# Altium schematic sheet Bank.SchDoc
size A3
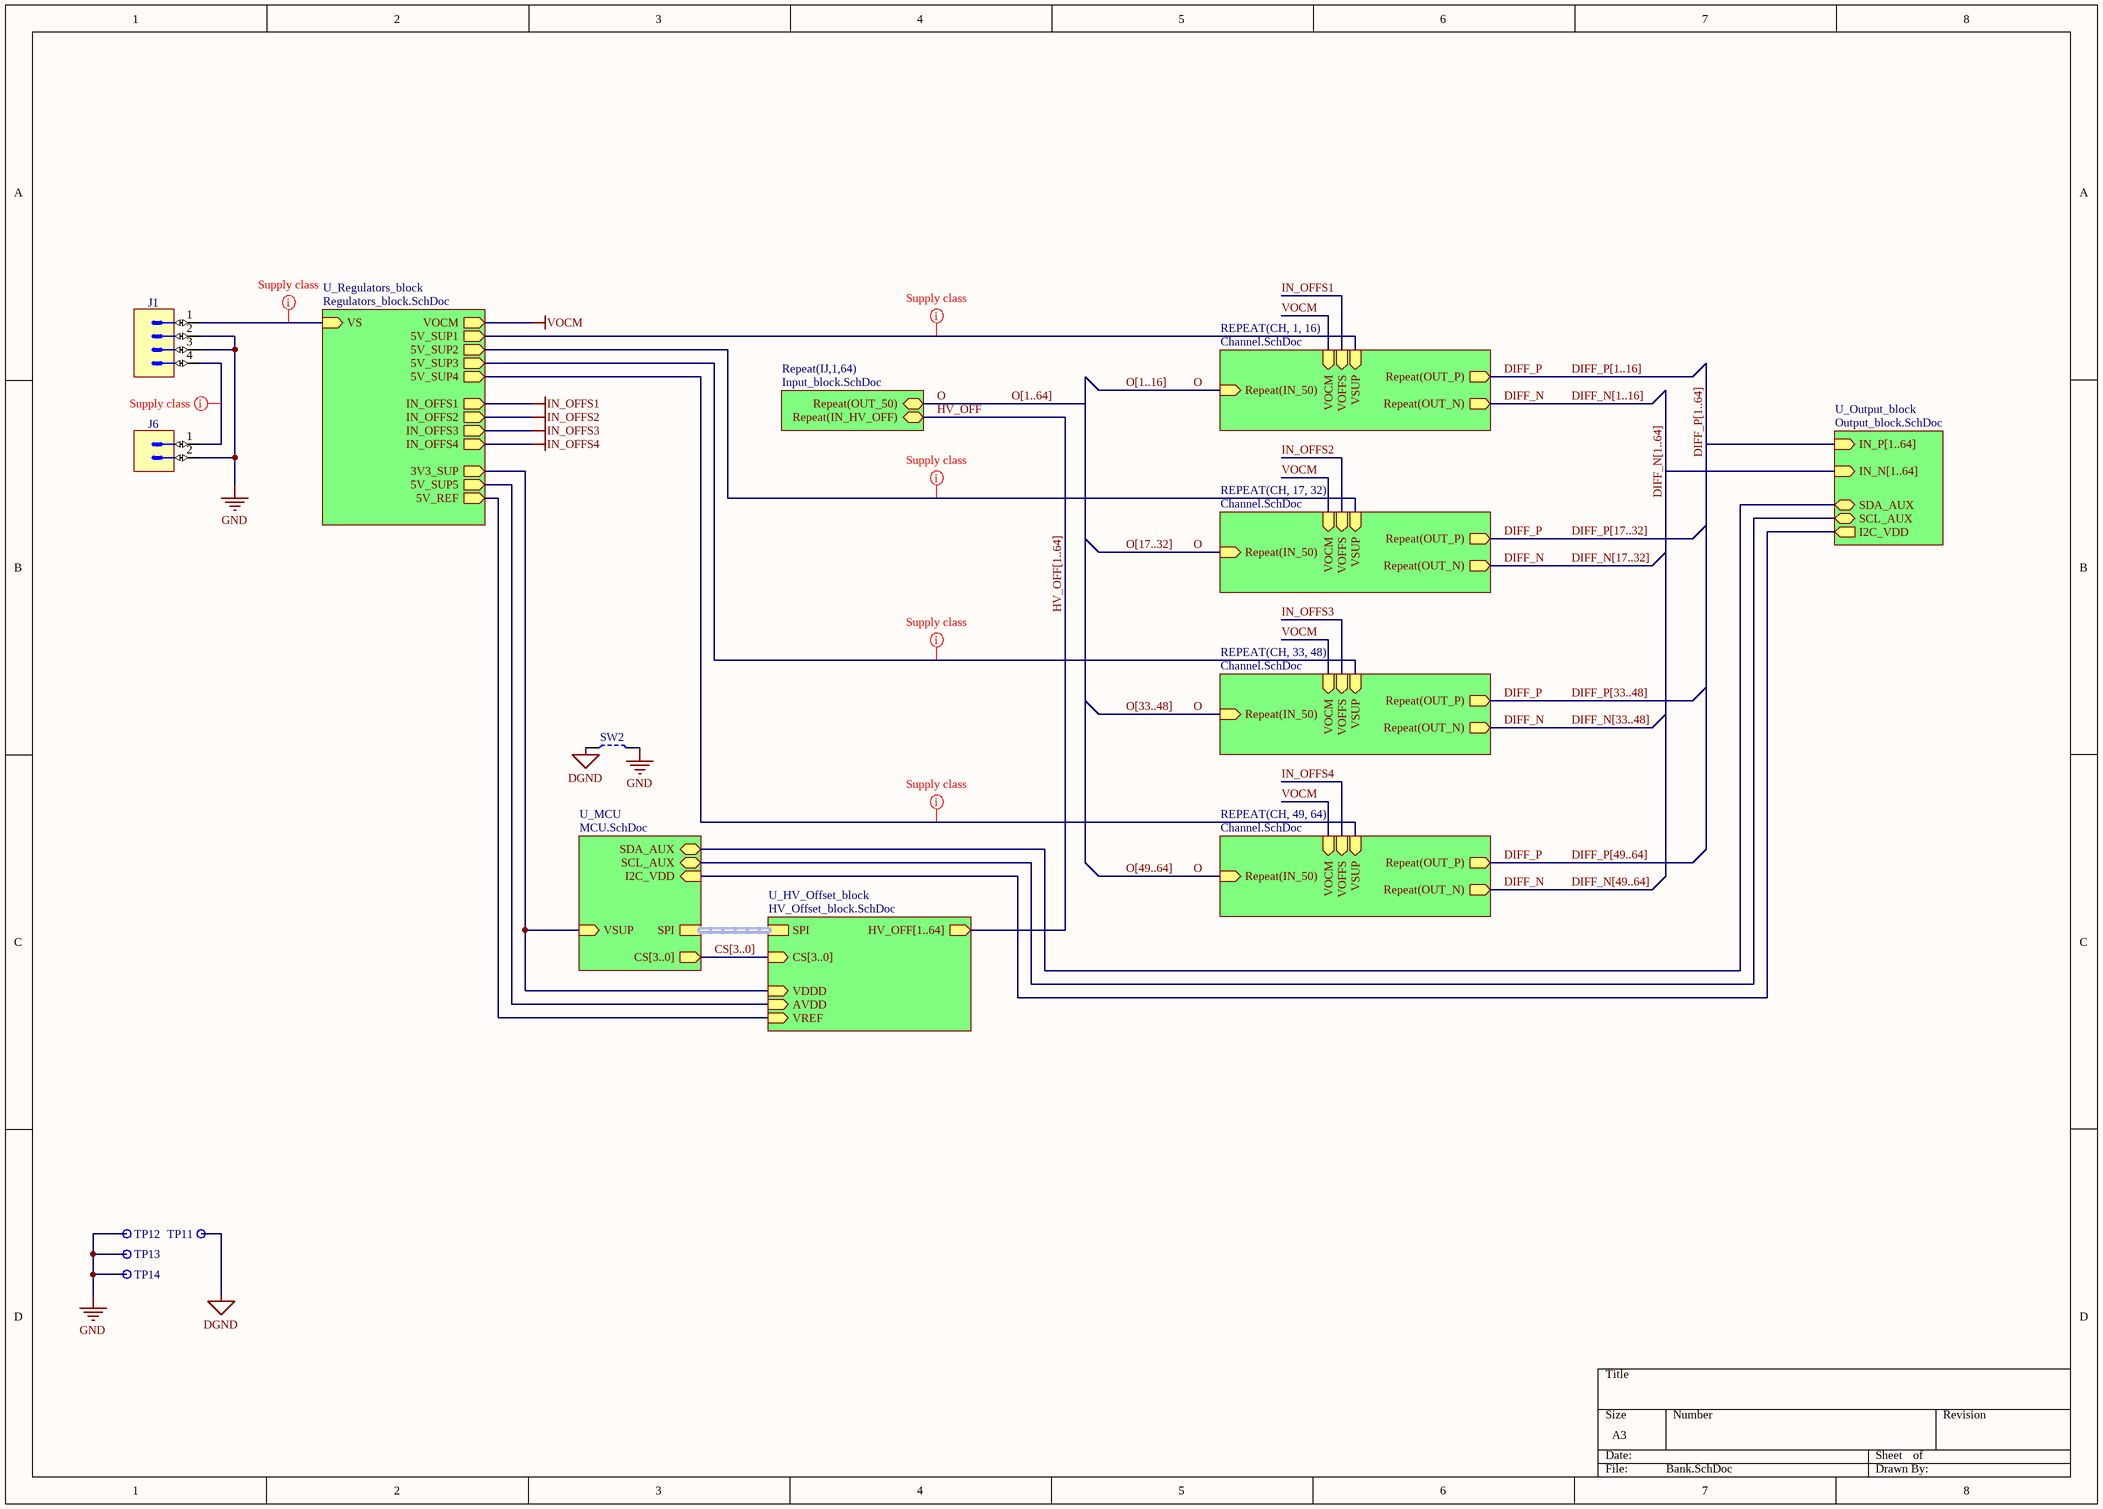
[diagram p0: Bank.SchDoc]

## Parts
J1  Header 4  [WURTH_691 313 410 004]  (value not drawn)
J6  KK®  [MOLEX_22-04-1021]  (value not drawn)
SW2  Switch  [JUMPSMD0805_G50]  (value not drawn)
TP11  Test Point  [VERO_20-313145]  (value not drawn)
TP12  Test Point  [VERO_20-313145]  (value not drawn)
TP13  Test Point  [VERO_20-313145]  (value not drawn)
TP14  Test Point  [VERO_20-313145]  (value not drawn)

## Sub-sheets
REPEAT(CH, 1, 16) = Channel.SchDoc: Repeat(OUT_N) (out), Repeat(OUT_P) (out), VSUP (in), Repeat(IN_50) (in), VOFFS (in), VOCM (in)
REPEAT(CH, 17, 32) = Channel.SchDoc: Repeat(OUT_N) (out), Repeat(OUT_P) (out), VSUP (in), Repeat(IN_50) (in), VOCM (in), VOFFS (in)
REPEAT(CH, 33, 48) = Channel.SchDoc: Repeat(OUT_N) (out), Repeat(OUT_P) (out), VSUP (in), Repeat(IN_50) (in), VOCM (in), VOFFS (in)
REPEAT(CH, 49, 64) = Channel.SchDoc: Repeat(OUT_N) (out), Repeat(OUT_P) (out), VSUP (in), Repeat(IN_50) (in), VOCM (in), VOFFS (in)
Repeat(IJ,1,64) = Input_block.SchDoc: Repeat(OUT_50) (bidir), Repeat(IN_HV_OFF) (bidir)
U_HV_Offset_block = HV_Offset_block.SchDoc: SPI (harness SPI), CS[3..0] (in), HV_OFF[1..64] (out), VDDD (in), AVDD (in), VREF (in)
U_MCU = MCU.SchDoc: CS[3..0] (out), VSUP (in), SPI (harness SPI), SDA_AUX (bidir), SCL_AUX (bidir), I2C_VDD (in)
U_Output_block = Output_block.SchDoc: IN_P[1..64] (in), IN_N[1..64] (in), I2C_VDD (out), SCL_AUX (bidir), SDA_AUX (bidir)
U_Regulators_block = Regulators_block.SchDoc: VS (in), IN_OFFS3 (out), 5V_SUP2 (out), VOCM (out), 5V_SUP4 (out), 5V_REF (out), IN_OFFS2 (out), 3V3_SUP (out), 5V_SUP3 (out), IN_OFFS1 (out), IN_OFFS4 (out), 5V_SUP1 (out), 5V_SUP5 (out)

## Nets
DGND: SW2.1 TP11.1
GND: J1.2 J1.3 J6.2 SW2.2 TP12.1 TP13.1 TP14.1
IN_OFFS1: sheet REPEAT(CH, 1, 16)/VOFFS, sheet U_Regulators_block/IN_OFFS1
IN_OFFS2: sheet REPEAT(CH, 17, 32)/VOFFS, sheet U_Regulators_block/IN_OFFS2
IN_OFFS3: sheet REPEAT(CH, 33, 48)/VOFFS, sheet U_Regulators_block/IN_OFFS3
IN_OFFS4: sheet REPEAT(CH, 49, 64)/VOFFS, sheet U_Regulators_block/IN_OFFS4
VOCM: sheet REPEAT(CH, 1, 16)/VOCM, sheet REPEAT(CH, 17, 32)/VOCM, sheet REPEAT(CH, 33, 48)/VOCM, sheet REPEAT(CH, 49, 64)/VOCM, sheet U_Regulators_block/VOCM
DIFF_N: sheet REPEAT(CH, 1, 16)/Repeat(OUT_N), sheet REPEAT(CH, 17, 32)/Repeat(OUT_N), sheet REPEAT(CH, 33, 48)/Repeat(OUT_N), sheet REPEAT(CH, 49, 64)/Repeat(OUT_N)
DIFF_P: sheet REPEAT(CH, 1, 16)/Repeat(OUT_P), sheet REPEAT(CH, 17, 32)/Repeat(OUT_P), sheet REPEAT(CH, 33, 48)/Repeat(OUT_P), sheet REPEAT(CH, 49, 64)/Repeat(OUT_P)
HV_OFF: sheet Repeat(IJ,1,64)/Repeat(IN_HV_OFF)
O: sheet REPEAT(CH, 1, 16)/Repeat(IN_50), sheet REPEAT(CH, 17, 32)/Repeat(IN_50), sheet REPEAT(CH, 33, 48)/Repeat(IN_50), sheet REPEAT(CH, 49, 64)/Repeat(IN_50), sheet Repeat(IJ,1,64)/Repeat(OUT_50)
NetJ1_1: J1.1 ; sheet U_Regulators_block/VS
NetJ1_4: J1.4 J6.1
(unnamed): sheet REPEAT(CH, 1, 16)/VSUP, sheet U_Regulators_block/5V_SUP1
(unnamed): sheet REPEAT(CH, 17, 32)/VSUP, sheet U_Regulators_block/5V_SUP2
(unnamed): sheet U_Output_block/I2C_VDD, sheet U_MCU/I2C_VDD
(unnamed): sheet U_Output_block/SCL_AUX, sheet U_MCU/SCL_AUX
(unnamed): sheet U_Output_block/SDA_AUX, sheet U_MCU/SDA_AUX
(unnamed): sheet REPEAT(CH, 33, 48)/VSUP, sheet U_Regulators_block/5V_SUP3
(unnamed): sheet REPEAT(CH, 49, 64)/VSUP, sheet U_Regulators_block/5V_SUP4
(unnamed): sheet U_HV_Offset_block/VDDD, sheet U_MCU/VSUP, sheet U_Regulators_block/3V3_SUP
(unnamed): sheet U_HV_Offset_block/AVDD, sheet U_Regulators_block/5V_SUP5
(unnamed): sheet U_HV_Offset_block/VREF, sheet U_Regulators_block/5V_REF

## Buses and harness runs
bus CS[3..0] = sheet U_HV_Offset_block/CS[3..0] = sheet U_MCU/CS[3..0]
bus DIFF_N[1..16]
bus DIFF_N[1..64] = sheet U_Output_block/IN_N[1..64]
bus DIFF_N[17..32]
bus DIFF_N[33..48]
bus DIFF_N[49..64]
bus DIFF_P[1..16]
bus DIFF_P[1..64] = sheet U_Output_block/IN_P[1..64]
bus DIFF_P[17..32]
bus DIFF_P[33..48]
bus DIFF_P[49..64]
bus HV_OFF[1..64] = sheet U_HV_Offset_block/HV_OFF[1..64]
bus O[1..16]
bus O[1..64]
bus O[17..32]
bus O[33..48]
bus O[49..64]
harness sheet U_HV_Offset_block/SPI = sheet U_MCU/SPI

## Layout directives
net class Supply: (no net found under the mark), NetJ1_1, NetJ1_4

## Library data of the parts
J1 = WURTH_691 313 410 004: Connector 4 Male; Part Description: 4 Contacts, Single Row, Right Angled Serie 3134-7.62mm; Manufacturer: WURTH ELEKTRONIK; PressFit: No; Part Number: WURTH_691 313 410 004; Component Kind: Standard; Component Type: Standard; Pin Count: 4; Family: Header 4; Mounted: Yes; Socket: No; SMD: No; Sense: No; Status: None; Manufacturer Part Number: 691 313 410 004; ComponentHeight: 8.5mm; HelpURL: \\cern.ch\dfs\Applications\Altium\Datasheets\WURTH_691 313 410 004.pdf; Author: CERN DEM MR; CreateDate: 08.04.2016; LatestRevisionDate: 08.04.2016
J6 = MOLEX_22-04-1021: Connector 2 Male; Part Description: 2.5mm (.100") Pitch KK® Wire-to-Board Header, Vertical, with Friction Lock, 2 Circuits, Tin (Sn) Plating; Manufacturer: MOLEX; PressFit: No; Part Number: MOLEX_22-04-1021; Component Kind: Standard; Component Type: Standard; Pin Count: 2; Family: KK®; Mounted: Yes; Socket: No; SMD: No; Sense: No; Status: None; Manufacturer Part Number: 22-04-1021; ComponentHeight: 11.7mm; HelpURL: \\cern.ch\dfs\Applications\Altium\Datasheets\MOLEX_22-04-1021.pdf; Author: CERN DEM JLC; CreateDate: 09.02.2012; LatestRevisionDate: 09.02.2012
SW2 = JUMPSMD0805_G50: 2 SMD Pads for Bound by Solder  Drop; Part Description: 2 SMD Pads for Bound by Solder Drop - Equivalent Size 0805 - Gap 0.5mm; Manufacturer: None; Mounted: No; PressFit: No; Part Number: JUMPSMD0805_G50; Component Kind: Standard (No BOM); Component Type: Standard (No BOM); Pin Count: 2; PackageDescription: 2 SMD Pads for Bound by Solder Drop - Equivalent Size 0805 - Gap 0.5mm; Family: Switch; Socket: No; SMD: Yes; Sense: No; Status: None; Manufacturer Part Number: None; ComponentHeight: 0mm; HelpURL: None; Author: CERN DEM JLC; CreateDate: 26.08.2009; LatestRevisionDate: 09.09.2009
TP11-TP14 = VERO_20-313145: Part Description: Black Bead PCB Terminal Test Pin for 2.4mm PCB Thickness (1.32mm Hole); Manufacturer: VERO TECHNOLOGIES; PressFit: No; Part Number: VERO_20-313145; Component Kind: Standard; Component Type: Standard; Pin Count: 1; Family: Test Point; Mounted: Yes; Socket: No; SMD: No; Sense: No; Status: None; Manufacturer Part Number: 20-313145; ComponentHeight: 5.3mm; HelpURL: \\cern.ch\dfs\Applications\Altium\Datasheets\VERO_20-313145.pdf; Author: CERN DEM JLC; CreateDate: 15.07.2013; LatestRevisionDate: 15.07.2013